# EAGLE schematic current_monitor_v1-1 (EAGLE 6.5.0)
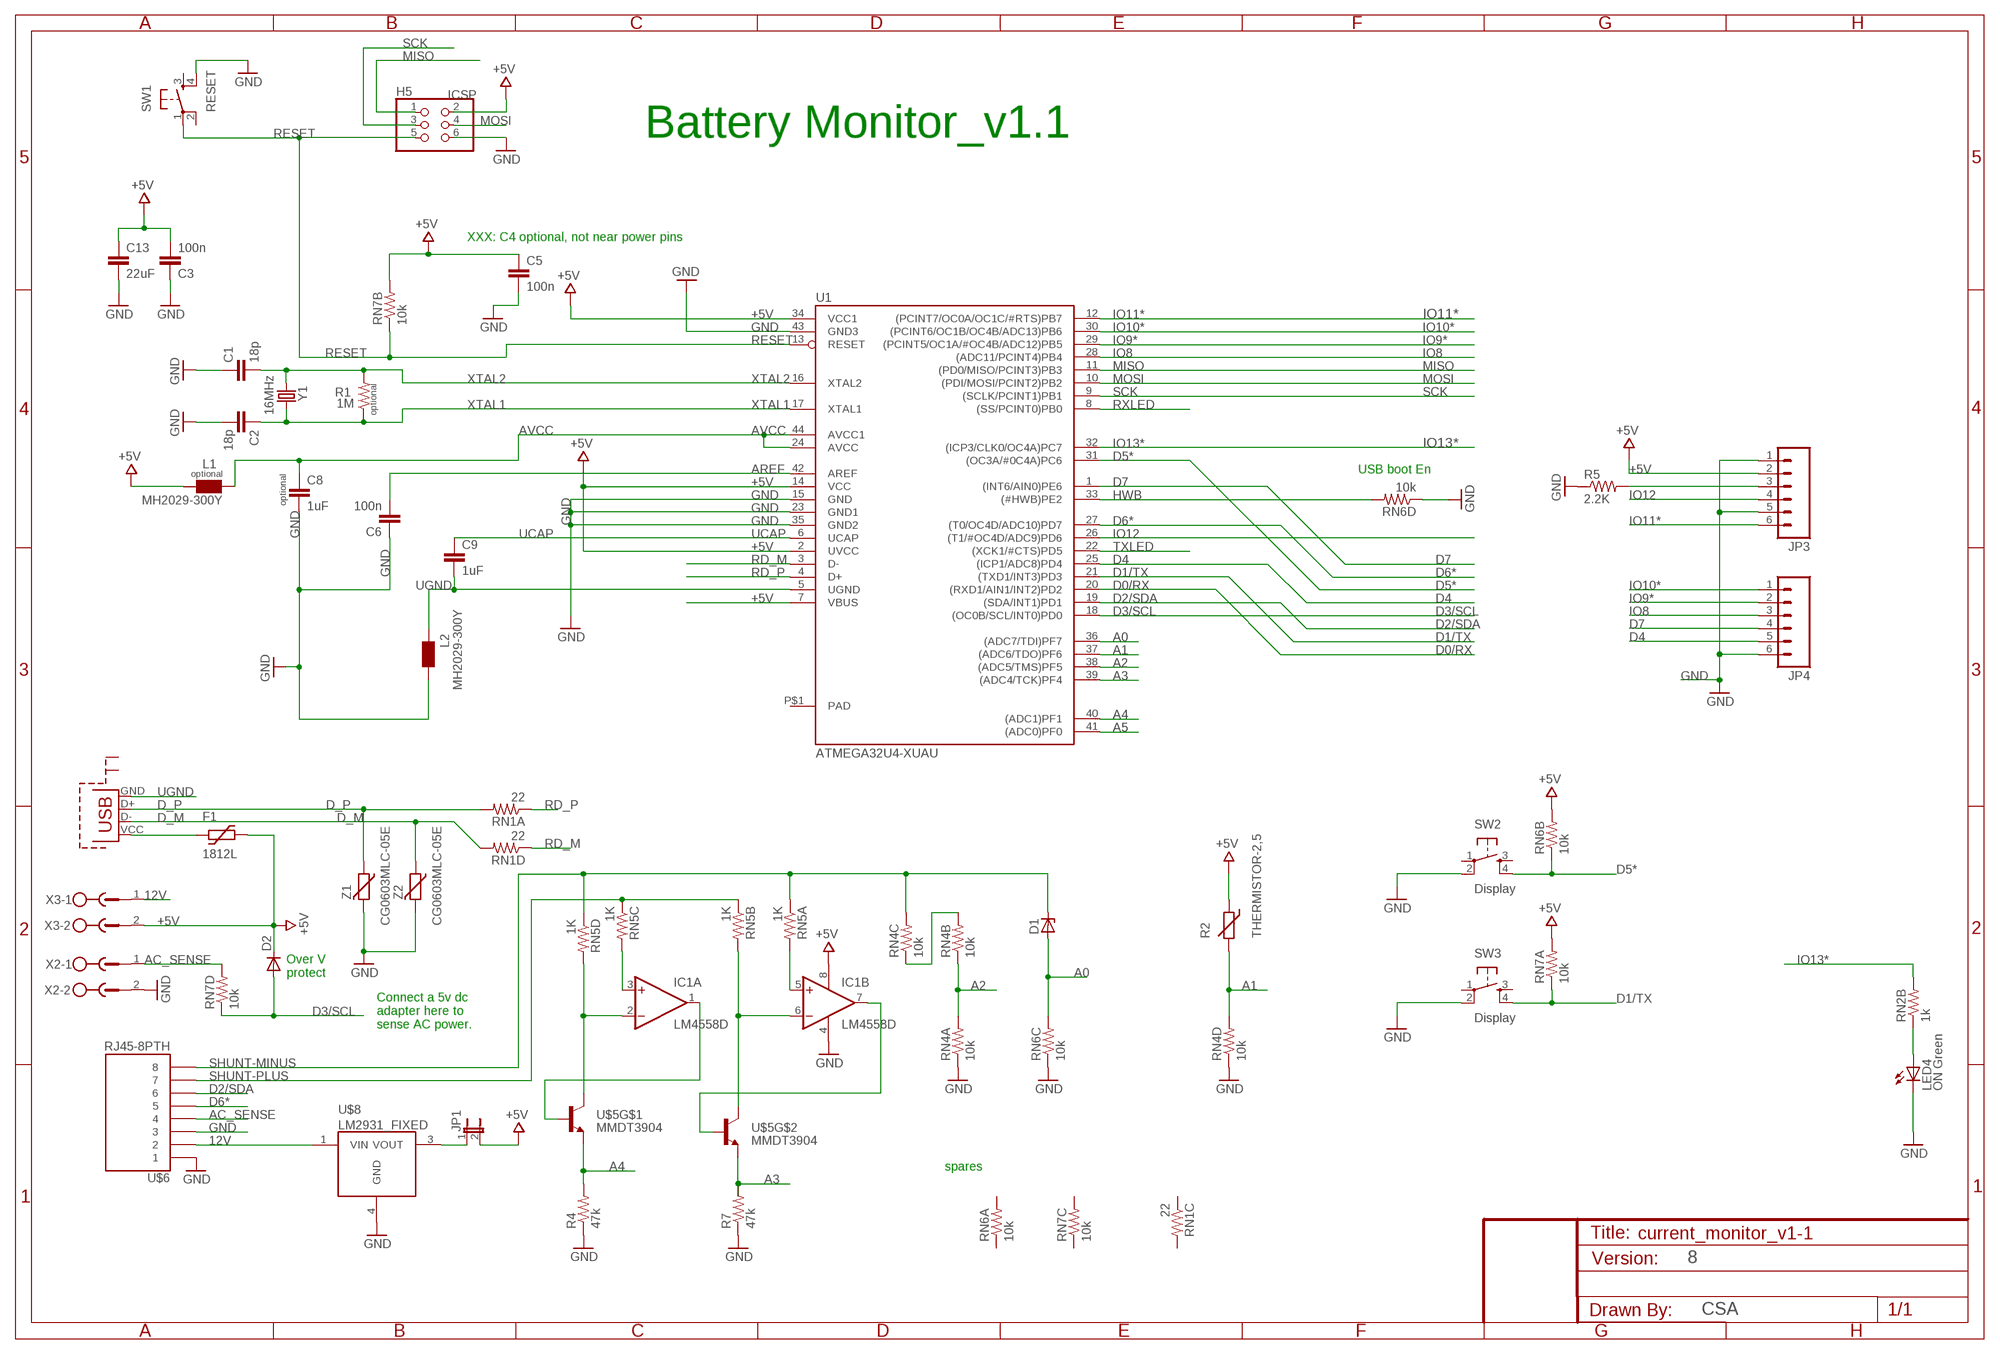
[diagram p0: schematic, sheet 1]

## Parts
C1  18p  CAP0805  [0805]
C2  18p  CAP0805  [0805]
C3  100n  CAP0805  [0805]
C5  100n  CAP0805  [0805]
C6  100n  CAP0805  [0805]
C8  1uF  CAP0805  [0805]
C9  1uF  CAP0805  [0805]
C13  22uF  CAP1206  [1206]
D1  ZENER-DIODEZD-5  [ZDIO-5]
D2  DIODESMA  [SMA-DIODE]
F1  1812L  [1812L]
H5  ICSP  PINHD-2X3  [2X03]
IC1  LM4558D  [SO08]
JP1  JUMPER-2-OLDPTH_LOCK  [1X02_LOCK]
JP3  M06FEMALE_LOCK  [1X06_FEMALE_LOCK.010]
JP4  M06FEMALE_LOCK  [1X06_FEMALE_LOCK.010]
L1  MH2029-300Y  WE-CBF_0805  [0805]
L2  MH2029-300Y  WE-CBF_0805  [0805]
LED4  ON Green  LED0805  [LED0805]
R1  1M  RESISTOR0805-RES  [0805]
R2  THERMISTOR-2,5  [RS-2,5]
R4  47k  RESISTOR0805-RES  [0805]
R5  2.2K  RESISTOR0805-RES  [0805]
R7  47k  RESISTOR0805-RES  [0805]
RN1  22  RESISTOR-ARRAYCRA06S  [CRA06S]
RN2  1k  RESISTOR-ARRAYCRA06S  [CRA06S]
RN4  10k  RESISTOR-ARRAYCRA06S  [CRA06S]
RN5  1K  RESISTOR-ARRAYCRA06S  [CRA06S]
RN6  10k  RESISTOR-ARRAYCRA06S  [CRA06S]
RN7  10k  RESISTOR-ARRAYCRA06S  [CRA06S]
SW1  RESET  TAC_SWITCHPTH  [TACTILE-PTH]
SW2  Display  TAC_SWITCHPTH  [TACTILE-PTH]
SW3  Display  TAC_SWITCHPTH  [TACTILE-PTH]
U1  ATMEGA32U4-XUAU  [TQFP44-PAD]
U$5  MMDT3904  [SOT363]
U$6  RJ45-8PTH  [RJ45-8]
U$8  LM2931_FIXED  [DPAK]
U$12  USB-MICRO-B-EVT  [USB-MICRO-B-UNIVERSAL-SOLID-FOOTS]
X2  MSTBV2  [MSTBV2]
X3  MSTBV2  [MSTBV2]
Y1  16MHz  CRYSTALHC49US  [HC49US]
Z1  CG0603MLC-05E  VARISTORCN0603  [CT/CN0603]
Z2  CG0603MLC-05E  VARISTORCN0603  [CT/CN0603]

## Nets
12V: U$6.2 U$8.1(VIN) X3.1
+5V [power]: C3.2 C5.1 C13.1 D2.C F1.P$2 H5.2 IC1.8(P:V+) JP1.2 JP3.2 L1.1 R2.1 RN6.7 RN7.7 RN7.8 U1.2(UVCC) U1.7(VBUS) U1.14(VCC) U1.34(VCC1) X3.2
A0: D1.A RN6.6 U1.36((ADC7/TDI)PF7)
A1: R2.2 RN4.5 U1.37((ADC6/TDO)PF6)
A2: RN4.2 RN4.8 U1.38((ADC5/TMS)PF5)
A3: R7.2 U1.39((ADC4/TCK)PF4) U$5.1(E)
A4: R4.2 U1.40((ADC1)PF1) U$5.4(E)
A5: U1.41((ADC0)PF0)
AC_SENSE: RN7.5 U$6.4 X2.1
AREF [aref]: C6.2 U1.42(AREF)
AVCC: C8.1 L1.2 U1.24(AVCC) U1.44(AVCC1)
D0/RX: U1.20((RXD1/AIN1/INT2)PD2)
D1/TX: RN7.1 SW3.4 U1.21((TXD1/INT3)PD3)
D2/SDA: U1.19((SDA/INT1)PD1) U$6.6
D3/SCL: D2.A RN7.4 U1.18((OC0B/SCL/INT0)PD0)
D4: JP4.5 U1.25((ICP1/ADC8)PD4)
D5*: RN6.2 SW2.4 U1.31((OC3A/#0C4A)PC6)
D6*: U1.27((T0/OC4D/ADC10)PD7) U$6.5
D7: JP4.4 U1.1((INT6/AIN0)PE6)
D_M: RN1.5 U$12.D- Z2.1
D_P: RN1.8 U$12.D+ Z1.1
GND [gnd]: C1.1 C2.2 C3.1 C5.2 C6.1 C8.2 C13.2 H5.6 IC1.4(P:V-) JP3.1 JP3.5 JP4.6 L2.2 LED4.C R4.1 R5.1 R7.1 RN4.1 RN4.4 RN6.3 RN6.4 SW1.4 SW2.2 SW3.2 U1.15(GND) U1.23(GND1) U1.35(GND2) U1.43(GND3) U$6.1 U$6.3 U$8.4(GND) X2.2 Z1.2 Z2.2
HWB: RN6.5 U1.33((#HWB)PE2)
IO8: JP4.3 U1.28((ADC11/PCINT4)PB4)
IO9*: JP4.2 U1.29((PCINT5/OC1A/#OC4B/ADC12)PB5)
IO10*: JP4.1 U1.30((PCINT6/OC1B/OC4B/ADC13)PB6)
IO11*: JP3.6 U1.12((PCINT7/OC0A/OC1C/#RTS)PB7)
IO12: JP3.4 U1.26((T1/#OC4D/ADC9)PD6)
IO13*: RN2.7 U1.32((ICP3/CLK0/OC4A)PC7)
LED4_ANODE: LED4.A RN2.2
MISO: H5.1 U1.11((PD0/MISO/PCINT3)PB3)
MOSI: H5.4 U1.10((PDI/MOSI/PCINT2)PB2)
N$1: IC1.6(B:-IN) RN5.7 U$5.6(C)
N$2: IC1.3(A:+IN) RN5.6
N$3: IC1.5(B:+IN) RN5.8
N$4: IC1.1(A:OUT) U$5.5(B)
N$5: IC1.7(B:OUT) U$5.2(B)
N$6: IC1.2(A:-IN) RN5.5 U$5.3(C)
N$7: F1.P$1 U$12.VCC(VBUS)
N$8: JP1.1 U$8.3(VOUT)
N$10: RN4.3 RN4.7
N$12: JP3.3 R5.2
RD_M: RN1.4 U1.3(D-)
RD_P: RN1.1 U1.4(D+)
RESET: H5.5 RN7.2 SW1.1 U1.13(RESET)
RXLED: U1.8((SS/PCINT0)PB0)
SCK: H5.3 U1.9((SCLK/PCINT1)PB1)
SHUNT-MINUS: D1.C RN4.6 RN5.1 RN5.4 U$6.8
SHUNT-PLUS: RN5.2 RN5.3 U$6.7
TXLED: U1.22((XCK1/#CTS)PD5)
UCAP: C9.1 U1.6(UCAP)
UGND [gnd]: C9.2 L2.1 U1.5(UGND) U$12.GND
XTAL1: C2.1 R1.1 U1.17(XTAL1) Y1.2
XTAL2: C1.2 R1.2 U1.16(XTAL2) Y1.1
Unconnected: RN1.2 RN1.3 RN1.6 RN1.7 RN2.1 RN2.3 RN2.4 RN2.5 RN2.6 RN2.8 RN6.1 RN6.8 RN7.3 RN7.6 SW1.2 SW1.3 SW2.1 SW2.3 SW3.1 SW3.3 U$12.P$1(SHIELD2) U$12.P$4(SHIELD1)

## Notes on the sheet
- Battery Monitor_v1.1
- XXX: C4 optional, not near power pins
- optional
- USB boot En
- optional
- optional
- Over V
  protect
- Connect a 5v dc
  adapter here to 
  sense AC power.
- spares
- 8
- CSA

## Power pins joined to a net without a drawn wire
PAD: U1.P$1(PAD)

## Library data of the parts
C1-C3 C5 C6 C8 C9 C13 = SparkFun-Passives:CAP: Capacitor Standard 0603 ceramic capacitor, and 0.1" leaded capacitor.
D1 = diode:ZENER-DIODE: Z-Diode
D2 = SparkFun-DiscreteSemi:DIODE: Diode These are standard reverse protection diodes and small signal diodes. SMA package can handle up to about 1A. SOD-323 can handle about 200mA. What the SOD-323 package when ordering, there are some mfgs out there that are 5-pin packages.
F1 = ptc-littlefuse:1812L
H5 = SmartPrj:PINHD-2X3: PIN HEADER
IC1 = linear:*4558: OP AMP
JP1 = SparkFun-Passives:JUMPER-2-OLD: Jumper Basic 0.1" spaced jumper. Use with breakaway headers.
JP3 JP4 = SparkFun-Connectors:M06: Header 6 Standard 6-pin 0.1" header. Use with straight break away headers (SKU : PRT-00116), right angle break away headers (PRT-00553), swiss pins (PRT-00743), machine pins (PRT-00117), and female headers (PRT-00115). Molex polarized connector foot print use with SKU : PRT-08094 with associated crimp pins and housings. NOTES ON THE VARIANTS LOCK and LOCK_LONGPADS... This footprint was designed to help hold the alignment of a through-hole component (i.e. 6-pin header) while soldering it into place. You may notice that each hole has been shifted either up or down by 0.005 of an inch from it's more standard position (which is a perfectly straight line). This slight alteration caused the pins (the squares in the middle) to touch the edges of the holes. Because they are alternating, it causes a "brace" to hold the component in place. 0.005 has proven to be the perfect amount of "off-center" position when using our standard breakaway headers. Although looks a little odd when you look at the bare footprint, once you have a header in there, the alteration is very hard to notice. Also, if you push a header all the way into place, it is covered up entirely on the bottom side. This idea of altering the position of holes to aid alignment will be further integrated into the Sparkfun Library for other footprints. It can help hold any component with 3 or more connection pins.
L1 L2 = wuerth-elektronik:WE-CBF: SMD EMI Suppression Ferrite Beads - excellent anti-EMI properties - low DCR - impedances till 3000 ohms - rated current up to 6 A
LED4 = xorduino:LED
R1 R4 R5 R7 = SparkFun-Passives:RESISTOR: Resistor Basic schematic elements and footprints for 0603, 1206, and PTH resistors.
R2 = varistor:THERMISTOR: THERMISTOR
RN1 RN2 RN4-RN7 = xorduino:RESISTOR-ARRAY
SW1-SW3 = SparkFun-Electromechanical:TAC_SWITCH: Momentary Switch Button commonly used for reset or general input. Spark Fun Electronics SKU : COM-00097
U1 = SmartPrj:ATMEGA32U4-XU
U$5 = SparkFun-DiscreteSemi:MMDT3904: Dual NPN transistor
U$6 = SparkFun-Connectors:RJ45-8: RJ45 Jack Simple RJ45, 8-pin connection - connector for common Cat5, Cat5e, and Cat6 Ethernet cables. Footprint not yet proven in production. Connector sku is PRT-00643; Breakout PCB sku is BOB-00716.
U$8 = SparkFun-PowerIC:LM2931_FIXED: LDO regulator with reverse battery protection- very durable!
U$12 = _usb_micro_b:USB-MICRO-B: USB MICRO B SOCKET 2 shielded pins
X2 X3 = con-phoenix-500:MSTBV2: PHOENIX; OC_FARNELL: unknown; OC_NEWARK: unknown
Y1 = SparkFun-FreqCtrl:CRYSTAL: Various standard crystals. Proven footprints. Spark Fun Electronics SKU : COM-00534
Z1 Z2 = varistor:VARISTOR: VARISTOR

## Net classes
0 default: width 0.203 mm, drill 0.406 mm, clearance 0.205 mm
1 power: width 0.203 mm, drill 0.406 mm, clearance 0.205 mm to class 0, clearance 0.205 mm
2 gnd: width 0.203 mm, drill 0.406 mm, clearance 0.205 mm to class 0, clearance 0.205 mm to class 1, clearance 0.205 mm
3 usbvcc: width 0.203 mm, drill 0.406 mm, clearance 0.203 mm
4 aref: width 0.203 mm, drill 0.406 mm, clearance 0.205 mm to class 0, clearance 0.205 mm to class 1, clearance 0.205 mm to class 2, clearance 0.205 mm to class 3, clearance 0.205 mm